# Altium schematic sheet PowerSupply.SchDoc
size A4; SheetNumber: 2; SheetTotal: 2
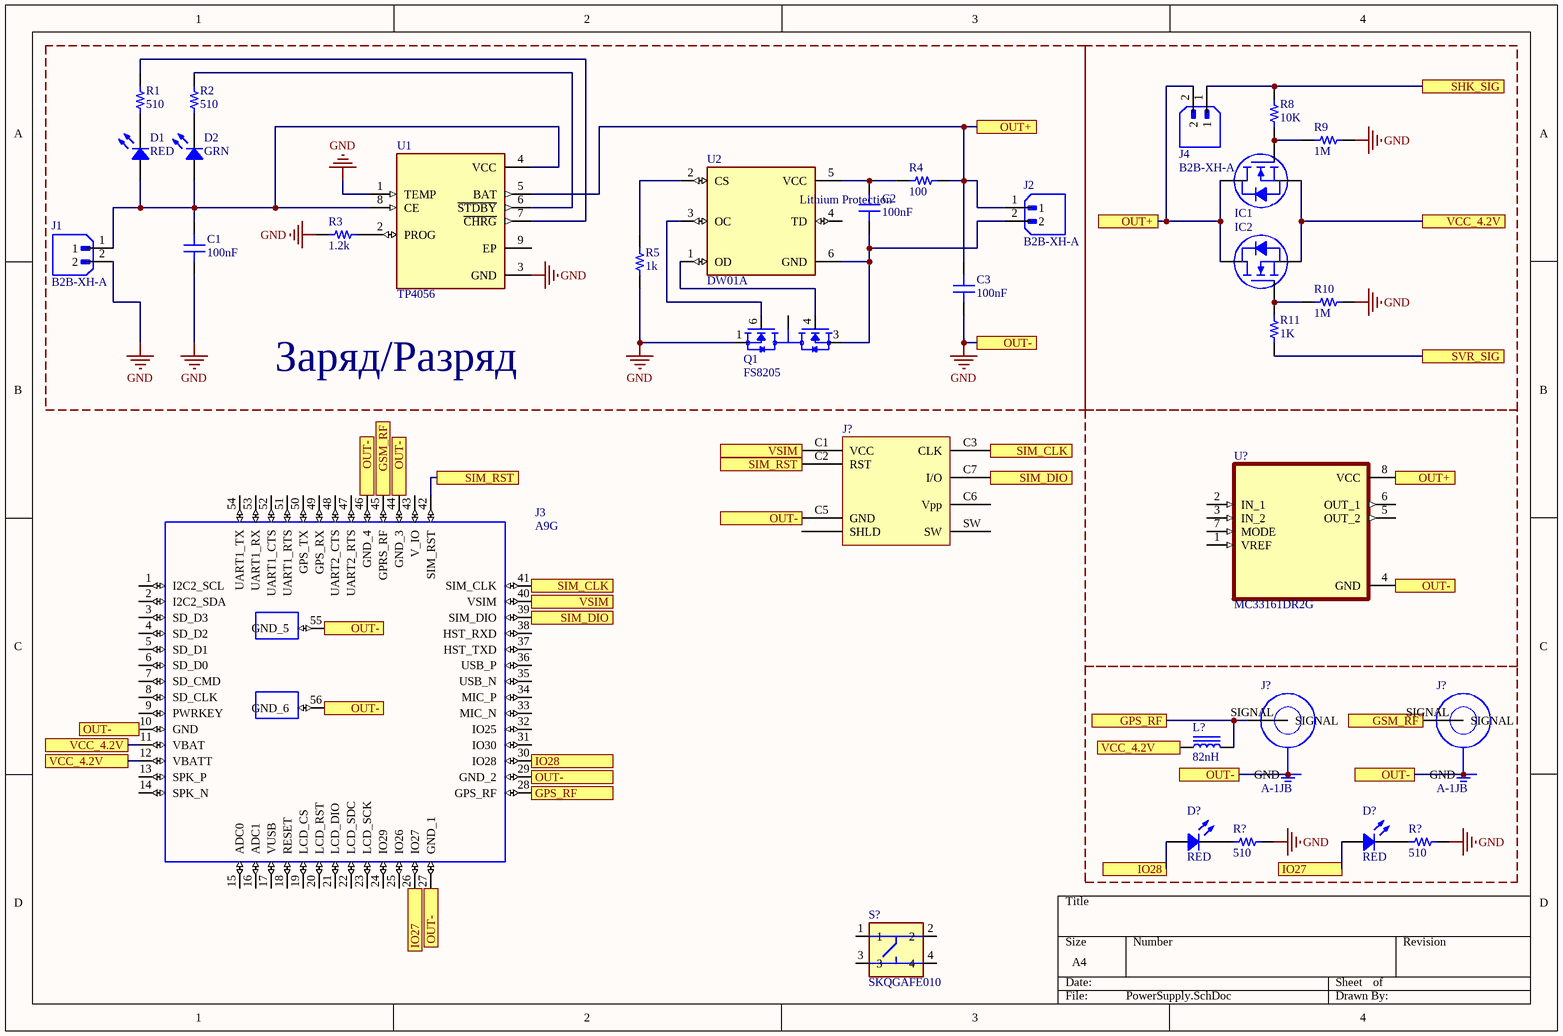
[diagram p0: PowerSupply.SchDoc]

## Parts
(Parts that share a designator on the sheet are numbered #1, #2 ... from top to bottom, then left to right.)
C1  100nF  [CAP 1206_3216 - 0.8MM]
C2  100nF  [CAP 1206_3216 - 0.8MM]
C3  100nF  [CAP 1206_3216 - 0.8MM]
D1  RED  [LED 1206_3216 RED]
D2  GRN  [LED 1206_3216 GREEN]
D?#1  RED  [LED 1206_3216 RED]
D?#2  RED  [LED 1206_3216 RED]
IC1  DMN30H4D0L-7  [DIODES SOT-23-3]  (value not drawn)
IC2  DMN30H4D0L-7  [DIODES SOT-23-3]  (value not drawn)
J1  B2B-XH-A  [JST_B2B-XH-A]
J2  B2B-XH-A  [JST_B2B-XH-A]
J3  A9G  [A9]
J4  B2B-XH-A  [JST_B2B-XH-A]
J?#1  SIM8060-6-1-14-00-A  [GCT SIM8060-6-1-14-00-A]  (value not drawn)
J?#2  A-1JB  [AMPHENOL_A-1JB]
J?#3  A-1JB  [AMPHENOL_A-1JB]
L?  82nH  [IND 0603_1608 RF WW]
Q1  FS8205  [SOT95P280X145-6N]
R1  510  [RES 1206_3216]
R2  510  [RES 1206_3216]
R3  1.2k  [RES 1206_3216]
R4  100  [RES 1206_3216]
R5  1k  [RES 1206_3216]
R8  10K  [RES 1206_3216]
R9  1M  [RES 1206_3216]
R10  1M  [RES 1206_3216]
R11  1K  [RES 1206_3216]
R?#1  510  [RES 1206_3216]
R?#2  510  [RES 1206_3216]
S?  SKQGAFE010  [SW_SKQGAFE010]
U1  TP4056  [SOP127P600X175-9N]
U2  DW01A  [SOT23-6]
U?  MC33161DR2G  [SOIC127P600X175-8N]

## Blocks framed on the sheet
Заряд/Разряд: C1-C3 D1 D2 J1 J2 Q1 R1-R5 U1 U2

## Ports
GPS_RF (see PowerSupply[2D]), GPS_RF (see PowerSupply[3C]), GSM_RF (see PowerSupply[1B]), GSM_RF (see PowerSupply[4C]), IO27 (see PowerSupply[2D]), IO27 (see PowerSupply[4D]), IO28 (see PowerSupply[2C]), IO28 (see PowerSupply[3D]), OUT+ (see PowerSupply[3A]), OUT+ (see PowerSupply[3A], PowerSupply[4B]), OUT- (see PowerSupply[1B], PowerSupply[1C], PowerSupply[2B], PowerSupply[2C], PowerSupply[2D], PowerSupply[3B], PowerSupply[4C], PowerSupply[4D]), OUT- (see PowerSupply[1B], PowerSupply[1C], PowerSupply[2B], PowerSupply[2C], PowerSupply[2D], PowerSupply[3B], PowerSupply[4D]), OUT- (see PowerSupply[1B], PowerSupply[1C], PowerSupply[2B], PowerSupply[2C], PowerSupply[2D], PowerSupply[4C], PowerSupply[4D]), OUT- (see PowerSupply[1B], PowerSupply[1C], PowerSupply[2B], PowerSupply[2D], PowerSupply[3B], PowerSupply[4C], PowerSupply[4D]), OUT- (see PowerSupply[1B], PowerSupply[1C], PowerSupply[2C], PowerSupply[2D], PowerSupply[3B], PowerSupply[4C], PowerSupply[4D]), OUT- (see PowerSupply[1C], PowerSupply[2B], PowerSupply[2C], PowerSupply[2D], PowerSupply[3B], PowerSupply[4C], PowerSupply[4D]), SHK_SIG, SIM_CLK (see PowerSupply[2C]), SIM_CLK (see PowerSupply[3B]), SIM_DIO (see PowerSupply[2C]), SIM_DIO (see PowerSupply[3B]), SIM_RST (see PowerSupply[2B]), SVR_SIG, VCC_4.2V (see PowerSupply[1C], PowerSupply[3C]), VCC_4.2V (see PowerSupply[1C], PowerSupply[3C], PowerSupply[4A]), VCC_4.2V (see PowerSupply[1C], PowerSupply[4A]), VSIM (see PowerSupply[2B]), VSIM (see PowerSupply[2C])

## Nets
GND: C1.1 C3.1 J1.2 J3.10(GND) J3.27(GND_1) J3.29(GND_2) J3.44(GND_3) J3.46(GND_4) J3.55(GND_5) J3.56(GND_6) J?#1.C5(GND) J?#2.GND1(GND) J?#2.GND2(GND) J?#2.OPTIONAL_GND(GND) J?#3.GND1(GND) J?#3.GND2(GND) J?#3.OPTIONAL_GND(GND) Q1.1(S1) R3.1 R5.1 R9.2 R10.2 R?#1.2 R?#2.2 U1.1(TEMP) U1.3(GND) U?.4(GND) ; port OUT-
GPS_RF: J3.28(GPS_RF) J?#2.SIGNAL L?.2 ; port GPS_RF
GSM_RF: J3.45(GPRS_RF) J?#3.SIGNAL ; port GSM_RF
IO27: D?#2.1 J3.26(IO27) ; port IO27
IO28: D?#1.1 J3.30(IO28) ; port IO28
OUT+: C3.2 IC1.3(D) IC2.3(D) J2.1 J4.2 R4.2 U1.5(BAT) U?.8(VCC) ; port OUT+
SHK_SIG: J4.1 R8.2 ; port SHK_SIG
SIM_CLK: J3.41(SIM_CLK) J?#1.C3(CLK) ; port SIM_CLK
SIM_DIO: J3.39(SIM_DIO) J?#1.C7(I/O) ; port SIM_DIO
SIM_RST: J3.42(SIM_RST) J?#1.C2(RST) ; port SIM_RST
SVR_SIG: R11.1 ; port SVR_SIG
VCC_4.2V: IC1.2(S) IC2.2(S) J3.11(VBAT) J3.12(VBATT) L?.1 ; port VCC_4.2V
VSIM: J3.40(VSIM) J?#1.C1(VCC) ; port VSIM
NetC1_2: C1.2 D1.1 D2.1 J1.1 U1.4(VCC) U1.8(CE)
NetC2_1: C2.1 J2.2 Q1.3(S2) U2.6(GND)
NetC2_2: C2.2 R4.1 U2.5(VCC)
NetD1_2: D1.2 R1.1
NetD2_2: D2.2 R2.1
NetD?#1_2: D?#1.2 R?#1.1
NetD?#2_2: D?#2.2 R?#2.1
NetIC1_1: IC1.1(G) R8.1 R9.1
NetIC2_1: IC2.1(G) R10.1 R11.2
NetQ1_2: Q1.2(D12) Q1.5(D12)
NetQ1_4: Q1.4(G2) U2.1(OD)
NetQ1_6: Q1.6(G1) U2.3(OC)
NetR1_2: R1.2 U1.7(~{CHRG})
NetR2_2: R2.2 U1.6(~{STDBY})
NetR3_2: R3.2 U1.2(PROG)
NetR5_2: R5.2 U2.2(CS)

Not connected (* = marked no-connect by the designer): J3 1(I2C2_SCL) 2(I2C2_SDA) 3(SD_D3) 4(SD_D2) 5(SD_D1) 6(SD_D0) 7(SD_CMD) 8(SD_CLK) 9(PWRKEY) 13(SPK_P) 14(SPK_N) 15(ADC0) 16(ADC1) 17(VUSB) 18(RESET) 19(LCD_CS) 20(LCD_RST) 21(LCD_DIO) 22(LCD_SDC) 23(LCD_SCK) 24(IO29) 25(IO26) 31(IO30) 32(IO25) 33(MIC_N) 34(MIC_P) 35(USB_N) 36(USB_P) 37(HST_TXD) 38(HST_RXD) 43(V_IO) 47(UART2_RTS) 48(UART2_CTS) 49(GPS_RX) 50(GPS_TX) 51(UART1_RTS) 52(UART1_CTS) 53(UART1_RX) 54(UART1_TX); J?#1 C6(Vpp) S(SHLD) SW; S? 1 2 3 4; U1 9(EP); U2 4(TD); U? 1(VREF) 2(IN_1) 3(IN_2) 5(OUT_2) 6(OUT_1) 7(MODE)

## Notes on the sheet
- (in symbol DW01A) Lithium Protection

## Library data of the parts
C1-C3 = CC1206ZRY5V9BB104: CAP CER 0.1UF 50V Y5V 1206; Part Number: CC1206ZRY5V9BB104; Value: 100nF
D1 D?#1 D?#2 = BL-HUF33J-AV-TRB: 1206 RED; Part Number: BL-HUF33J-AV-TRB
D2 = 5976325607F: LED GREEN 1206 SMD; Part Number: 5976325607F
IC1 IC2 = DMN30H4D0L-7: MOSFET N-CH 300V 250MA SOT23; Manufacturer: Diodes Incorporated; Current - Continuous Drain (Id) @ 25°C: 250mA (Ta); Drive Voltage (Max Rds On,  Min Rds On): 2.7V, 10V; FET Type: N-Channel; Gate Charge (Qg) (Max) @ Vgs: 7.6 nC @ 10 V; Input Capacitance (Ciss) (Max) @ Vds: 187.3 pF @ 25 V; Power Dissipation (Max): 310mW (Ta); Rds On (Max) @ Id, Vgs: 4Ohm @ 300mA, 10V; Vgs (Max): ±20V; Vgs(th) (Max) @ Id: 3V @ 250µA; Part Number: DMN30H4D0L-7; ComponentLink1Description: Datasheet; ComponentLink1URL: https://www.diodes.com/assets/Datasheets/DMN30H4D0L.pdf; ComponentLink2Description: DigiKey Link; ComponentLink2URL: https://www.digikey.com/en/products/detail/diodes-incorporated/DMN30H4D0L-7/4794790; Drain to Source Voltage (Vdss): 300 V; LastUpdated: 08.02.2024 21:46:11; Lifecycle Status: Active; Minimum Order: 1; Mounting Type: Surface Mount; Operating Temperature: -55°C ~ 150°C (TJ); Package / Case: TO-236-3, SC-59, SOT-23-3; Packaging: TapeAndReel; Part Status: Active; Price: 0.16; Series: -; Supplier 1: DigiKey; Supplier Part Number 1: DMN30H4D0L-7DICT-ND; Supplier Device Package: SOT-23-3; Technology: MOSFET (Metal Oxide)
J1 = B2B-XH-A: зарядка; MF: {'manufacturer': u'JST Sales America Inc.'}; Package: None; Price: None; Value: *; MP: B2B-XH-A; Availability: Unavailable
J2 = B2B-XH-A: батарея; MF: {'manufacturer': u'JST Sales America Inc.'}; Package: None; Price: None; Value: *; MP: B2B-XH-A; Availability: Unavailable
J3 = A9G: Cellular, Navigation Beidou, GNSS, GPRS, GPS, GSM Transceiver Module 800MHz, 900MHz, 1.8GHz, 1.9GHz Antenna Not Included Surface Mount; MF: Ai-Thinker; Package: None; Price: None; Check_prices: https://www.snapeda.com/parts/A9G/AI-Thinker/view-part/?ref=eda; Value: *; SnapEDA_Link: https://www.snapeda.com/parts/A9G/AI-Thinker/view-part/?ref=snap; MP: A9G; Availability: In Stock; Purchase-URL: https://pricing.snapeda.com/search?q=A9G&ref=eda
J4 = B2B-XH-A: чека; MF: {'manufacturer': u'JST Sales America Inc.'}; Package: None; Price: None; Value: *; MP: B2B-XH-A; Availability: Unavailable
J?#1 = SIM8060-6-1-14-00-A: CONN SIM NANO HINGED 6P W/SWITCH; Manufacturer: GCT; Card Type: NANO SIM; Connector Type: Connector and Ejector; Insertion, Removal Method: Hinged Lid; Number of Positions: 6; Part Number: SIM8060-6-1-14-00-A; ComponentLink1Description: Datasheet; ComponentLink1URL: https://gct.co/files/drawings/sim8060.pdf; ComponentLink2Description: DigiKey Link; ComponentLink2URL: http://digikey.com/product-detail/en/gct/SIM8060-6-1-14-00-A/2073-SIM8060-6-1-14-00-ACT-ND/10127236; Contact Finish: Gold; Contact Finish Thickness: 1.00µin (0.025µm); Height Above Board: 0.056" (1.42mm); LastUpdated: 30.03.2020 15:26:01; Lifecycle Status: Active; Minimum Order: 1; Mounting Feature: Normal, Standard - Top; Mounting Type: Surface Mount, Right Angle; Packaging: TapeAndReel; Part Status: Active; Price: 0.70; Series: SIM8060; Supplier 1: DigiKey; Supplier Part Number 1: 2073-SIM8060-6-1-14-00-ACT-ND
J?#2 J?#3 = A-1JB: AMC Straight PCB Jack, Surface Mount, 2500 pc Reel, 50 Ohm; Package: None; MP: A-1JB; Price: None; Availability: Unavailable; Value: *
L? = LQW18AN82NJ8ZD: FIXED IND 82NH 550MA 500 MOHM; Manufacturer: Murata Electronics; DC Resistance (DCR): 500mOhm Max; Frequency - Self Resonant: 2.23GHz; Inductance Frequency - Test: 100MHz; Material - Core: Non-Magnetic; Q @ Freq: 34 @ 150MHz; Shielding: Unshielded; Tolerance: ±5%; Type: Wirewound; Part Number: LQW18AN82NJ8ZD; ComponentLink1Description: Datasheet; ComponentLink1URL: https://search.murata.co.jp/Ceramy/image/img/P02/JELF243A-9133.pdf; ComponentLink2Description: DigiKey Link; ComponentLink2URL: http://digikey.com/product-detail/en/murata-electronics/LQW18AN82NJ8ZD/490-15747-1-ND/6800412; Current Rating (Amps): 550mA; Device Package: 0603 (1608 Metric); Height - Seated (Max): 0.039" (1.00mm); Inductance: 82nH; LastUpdated: 06.09.2020 11:05:19; Lifecycle Status: Active; Minimum Order: 1; Mounting Type: Surface Mount; Operating Temperature: -55°C ~ 125°C; Package / Case: 0603 (1608 Metric); Packaging: TapeAndReel; PartId: 1164; Part Status: Active; Price: 0.09; Ratings: AEC-Q200; Series: LQW18; Size / Dimension: 0.063" L x 0.031" W (1.60mm x 0.80mm); Supplier 1: DigiKey; Supplier Part Number 1: 490-15747-1-ND; Supplier Device Package: 0603 (1608 Metric); Value: 82nH
Q1 = FS8205: Dual N-Channel Enhancement Mode Power MOSFET; MF: Fortune Semiconductor; SnapEDA_Link: https://www.snapeda.com/parts/FS8205/Fortune+Semiconductor/view-part/?ref=snap; Package: Package; MP: FS8205; Check_prices: https://www.snapeda.com/parts/FS8205/Fortune+Semiconductor/view-part/?ref=eda; Price: None; Value: *; Availability: Not in stock
R1 R2 R8-R11 R?#1 R?#2 = RC1206JR-07510RL: RES 510 OHM 5% 1/4W 1206; Part Number: RC1206JR-07510RL
R3 = AC1206JR-071K2L: RES SMD 1.2K OHM 5% 1/4W 1206; Part Number: AC1206JR-071K2L
R4 R5 = RT1206BRB07100KL: RES SMD 100K OHM 0.1% 1/4W 1206; Part Number: RT1206BRB07100KL
S? = SKQGAFE010: Switch Tactile N.O. SPST Button Gull Wing 0.05A 12VDC 0.98N SMD T/R; MF: ALPS; Price: None; Availability: In Stock; Package: None; MP: SKQGAFE010; Value: *; Purchase-URL: https://pricing.snapeda.com/search/part/SKQGAFE010/?ref=eda
U1 = TP4056: Complete single cell Li-Ion battery with a constant current / constant voltage linear charger; MF: NanJing Top Power ASIC Corp.; Check_prices: https://www.snapeda.com/parts/TP4056/NanJing+Top+Power+ASIC+Corp./view-part/?ref=eda; SnapEDA_Link: https://www.snapeda.com/parts/TP4056/NanJing+Top+Power+ASIC+Corp./view-part/?ref=snap; Price: None; Availability: Not in stock; Package: Package; MP: TP4056; Value: *
U2 = DW01A: One Cell Lithium-ion/Polymer Battery Protection IC; MF: Fortune Semiconductor; SnapEDA_Link: https://www.snapeda.com/parts/DW01A/Fortune+Semiconductor/view-part/?ref=snap; Package: SOT-23-6 Fortune Semiconductor; Value: *; MP: DW01A; Check_prices: https://www.snapeda.com/parts/DW01A/Fortune+Semiconductor/view-part/?ref=eda
U? = MC33161DR2G: Supervisor Open Drain or Open Collector 2 Channel 8-SOIC; MF: ON Semiconductor; Package: SOIC-8 ON Semiconductor; Price: None; MP: MC33161DR2G; Purchase-URL: https://pricing.snapeda.com/search/part/MC33161DR2G/?ref=eda; Availability: In Stock; Value: *; Check_prices: https://www.snapeda.com/parts/MC33161DR2G/Onsemi/view-part/?ref=eda; SnapEDA_Link: https://www.snapeda.com/parts/MC33161DR2G/Onsemi/view-part/?ref=snap